# Altium schematic sheet HeaterControl.SchDoc
size A4
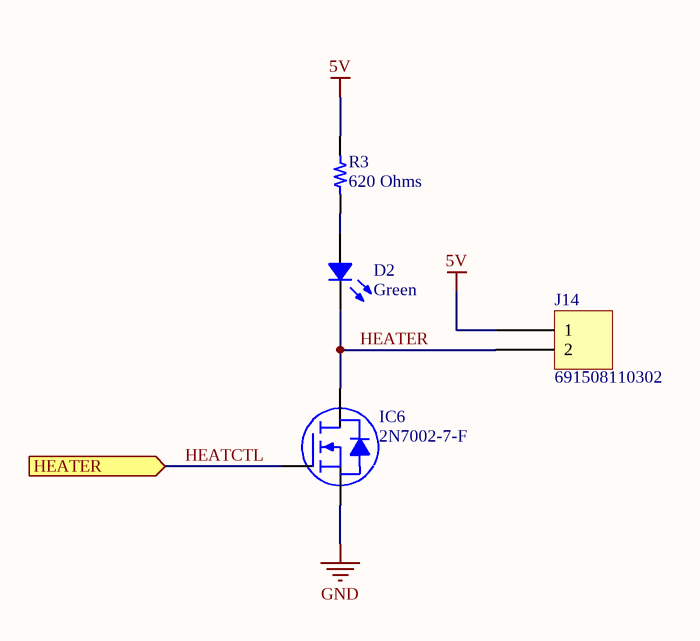
[diagram p0: HeaterControl.SchDoc]

## Parts
D2  Green  [LED 0603_1608 GREEN]
IC6  2N7002-7-F  [DIODES SOT-23-3]
J14  691508110302  [WURTH 691508110302]
R3  620 Ohms  [RES 0603_1608]

## Ports
HEATER (in)

## Nets
5V: J14.1 R3.2
GND: IC6.2(S)
HEATCTL: IC6.1(G) ; port HEATER
HEATER: D2.2 IC6.3(D) J14.2
NetD2_1: D2.1 R3.1

## Notes on the sheet
- Title
- Size:
- Date:
- A4
- Number:
- Time:
- Revision:
- Sheet
- of
- File:

## Library data of the parts
D2 = LTST-C190KGKT: LED GREEN CLEAR CHIP SMD; Manufacturer: Lite-On Inc.; Configuration: Standard; Current - Test: 20mA; Lens Color: Colorless; Lens Size: 1.10mm x 0.80mm; Lens Style: Rectangle with Flat Top; Millicandela Rating: 35mcd; Viewing Angle: 130°; Voltage - Forward (Vf) (Typ): 2V; Wavelength - Dominant: 571nm; Wavelength - Peak: 574nm; Part Number: LTST-C190KGKT; Color: Green; ComponentLink1Description: Datasheet; ComponentLink1URL: http://optoelectronics.liteon.com/upload/download/DS22-2000-074/LTST-C190KGKT.PDF; ComponentLink2Description: DigiKey Link; ComponentLink2URL: http://digikey.com/product-detail/en/lite-on-inc/LTST-C190KGKT/160-1435-1-ND/386814; Device Package: 0603 (1608 Metric); Height (Max): 0.90mm; LastUpdated: 21/01/2020 03:12:09; Lens Transparency: Clear; Lifecycle Status: Active; Minimum Order: 1; Mounting Type: Surface Mount; Package / Case: 0603 (1608 Metric); Packaging: TapeAndReel; PartId: 657; Part Status: Active; Price: 0.04; Series: -; Size / Dimension: 1.60mm L x 0.80mm W; Supplier 1: DigiKey; Supplier Part Number 1: 160-1435-1-ND; Supplier Device Package: Chip LED; Value: Green
IC6 = 2N7002-7-F: MOSFET N-CH 60V 115MA SOT23-3; Manufacturer: Diodes Incorporated; Current - Continuous Drain (Id) @ 25°C: 115mA (Ta); Drive Voltage (Max Rds On,  Min Rds On): 5V, 10V; FET Type: N-Channel; Input Capacitance (Ciss) (Max) @ Vds: 50pF @ 25V; Power Dissipation (Max): 370mW (Ta); Rds On (Max) @ Id, Vgs: 7.5Ohm @ 50mA, 5V; Vgs (Max): ±20V; Vgs(th) (Max) @ Id: 2.5V @ 250µA; Part Number: 2N7002-7-F; ComponentLink1Description: Datasheet; ComponentLink1URL: https://www.diodes.com/assets/Datasheets/ds11303.pdf; ComponentLink2Description: DigiKey Link; ComponentLink2URL: http://digikey.com/product-detail/en/diodes-incorporated/2N7002-7-F/2N7002-FDICT-ND/717800; Device Package: TO-236-3, SC-59, SOT-23-3; Drain to Source Voltage (Vdss): 60V; LastUpdated: 21/01/2020 04:00:25; Lifecycle Status: Active; Minimum Order: 1; Mounting Type: Surface Mount; Operating Temperature: -55°C ~ 150°C (TJ); Package / Case: TO-236-3, SC-59, SOT-23-3; Packaging: TapeAndReel; Part Status: Active; Price: 0.03; Series: -; Supplier 1: DigiKey; Supplier Part Number 1: 2N7002-FDICT-ND; Supplier Device Package: SOT-23-3; Technology: MOSFET (Metal Oxide)
J14 = 691508110302: TERM BLOCK 2POS 3.5MM SMD; Manufacturer: Würth Elektronik; Current: 10A; Mating Orientation: Horizontal and Vertical with Board; Number of Levels: 1; Pitch: 0.138" (3.50mm); Positions Per Level: 2; Voltage: 300V; Wire Gauge: 16-30 AWG; Wire Termination: Screw - Rising Cage Clamp; Part Number: 691508110302; Color: Black; ComponentLink1Description: Datasheet; ComponentLink1URL: https://katalog.we-online.de/em/datasheet/6915081103xx.pdf; ComponentLink2Description: DigiKey Link; ComponentLink2URL: http://digikey.com/product-detail/en/w-rth-elektronik/691508110302/732-5963-1-ND/5047612; Features: Board Guide, Mounting Flange; LastUpdated: 15/01/2020 04:18:55; Lifecycle Status: Active; Minimum Order: 1; Mounting Type: Surface Mount; Packaging: TapeAndReel; Part Status: Active; Price: 1.57; Series: WR-TBL Series 5081; Supplier 1: DigiKey; Supplier Part Number 1: 732-5963-1-ND
R3 = ERJ-3GEYJ621V: RES SMD 620 OHM 5% 1/10W 0603; Manufacturer: Panasonic Electronic Components; Power (Watts): 0.1W, 1/10W; Temperature Coefficient: ±200ppm/°C; Part Number: ERJ-3GEYJ621V; Value: 620 Ohms; ComponentLink1Description: Datasheet; ComponentLink1URL: http://industrial.panasonic.com/www-cgi/jvcr13pz.cgi?E+PZ+3+AOA0001+ERJ3GEYJ621V+7+WW; ComponentLink2Description: DigiKey Link; ComponentLink2URL: http://digikey.com/product-detail/en/panasonic-electronic-components/ERJ-3GEYJ621V/P620GCT-ND/134820; Composition: Thick Film; Device Package: 0603 (1608 Metric); Features: Automotive AEC-Q200; Height - Seated (Max): 0.022" (0.55mm); LastUpdated: 21/01/2020 00:23:40; Lifecycle Status: Active; Minimum Order: 1; Number of Terminations: 2; Operating Temperature: -55°C ~ 155°C; Package / Case: 0603 (1608 Metric); Packaging: TapeAndReel; PartId: 8112; Part Status: Active; Price: 0.01; Ratings: AEC-Q200; Resistance: 620 Ohms; Series: ERJ; Size / Dimension: 0.063" L x 0.031" W (1.60mm x 0.80mm); Supplier 1: DigiKey; Supplier Part Number 1: P620GCT-ND; Supplier Device Package: 0603; Tolerance: ±5%